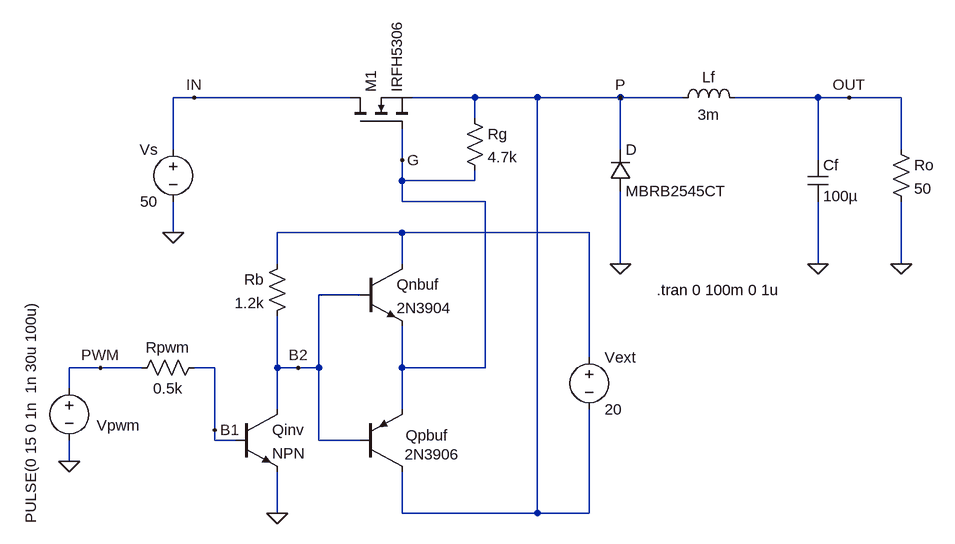
[diagram p0: schematic buck_converter_high_side_mosfet_gate_drive_using_sep_source_pushpull_config_70_duty.asc]
buck_converter_high_side_mosfet_gate_drive_using_sep_source_pushpull_config_70_duty.asc, the LTspice schematic file:
Version 4.1
SHEET 1 1028 932
WIRE -256 128 -288 128
WIRE -16 128 -256 128
WIRE 176 128 80 128
WIRE 272 128 176 128
WIRE 400 128 272 128
WIRE 496 128 400 128
WIRE 704 128 576 128
WIRE 752 128 704 128
WIRE 832 128 752 128
WIRE 176 160 176 128
WIRE -288 208 -288 128
WIRE 400 208 400 128
WIRE 832 208 832 128
WIRE 64 224 64 176
WIRE 704 224 704 128
WIRE 64 256 64 224
WIRE 176 256 176 240
WIRE 176 256 64 256
WIRE 64 288 64 256
WIRE 192 288 64 288
WIRE -288 336 -288 288
WIRE 64 336 -128 336
WIRE 352 336 64 336
WIRE -128 384 -128 336
WIRE 64 384 64 336
WIRE 400 384 400 272
WIRE 704 384 704 288
WIRE 832 384 832 288
WIRE 0 432 -64 432
WIRE 352 528 352 336
WIRE -400 544 -448 544
WIRE -336 544 -400 544
WIRE -224 544 -256 544
WIRE -128 544 -128 464
WIRE -96 544 -128 544
WIRE -64 544 -64 432
WIRE -64 544 -96 544
WIRE 64 544 64 480
WIRE 192 544 192 288
WIRE 192 544 64 544
WIRE -448 576 -448 544
WIRE -128 608 -128 544
WIRE 64 608 64 544
WIRE -224 640 -224 544
WIRE -224 656 -224 640
WIRE -192 656 -224 656
WIRE -64 656 -64 544
WIRE 0 656 -64 656
WIRE -448 688 -448 656
WIRE -128 768 -128 704
WIRE 64 768 64 704
WIRE 272 768 272 128
WIRE 272 768 64 768
WIRE 352 768 352 608
WIRE 352 768 272 768
FLAG 752 128 OUT
FLAG 400 128 P
FLAG 400 384 0
FLAG 832 384 0
FLAG 704 384 0
FLAG -448 688 0
FLAG -288 336 0
FLAG -128 768 0
FLAG 64 224 G
FLAG -400 544 PWM
FLAG -256 128 IN
FLAG -96 544 B2
FLAG -224 640 B1
SYMBOL voltage -288 192 M0
WINDOW 123 0 0 Left 0
WINDOW 39 0 0 Left 0
SYMATTR InstName Vs
SYMATTR Value 50
SYMBOL nmos -16 176 R270
SYMATTR InstName M1
SYMATTR Value IRFH5306
SYMBOL diode 384 272 M180
WINDOW 0 24 64 Left 2
WINDOW 3 24 0 Left 2
SYMATTR InstName D
SYMATTR Value MBRB2545CT
SYMBOL ind 480 144 R270
WINDOW 0 32 56 VTop 2
WINDOW 3 5 56 VBottom 2
SYMATTR InstName Lf
SYMATTR Value 3m
SYMBOL cap 688 224 R0
SYMATTR InstName Cf
SYMATTR Value 100µ
SYMBOL res 816 192 R0
SYMATTR InstName Ro
SYMATTR Value 50
SYMBOL npn 0 384 R0
SYMATTR InstName Qnbuf
SYMATTR Value 2N3904
SYMBOL res -240 528 R90
WINDOW 0 0 56 VBottom 2
WINDOW 3 32 56 VTop 2
SYMATTR InstName Rpwm
SYMATTR Value 0.5k
SYMBOL voltage -448 560 R0
WINDOW 3 -59 224 VLeft 2
WINDOW 123 0 0 Left 0
WINDOW 39 0 0 Left 0
WINDOW 0 42 73 Left 2
SYMATTR Value PULSE(0 15 0 1n  1n 30u 100u)
SYMATTR InstName Vpwm
SYMBOL pnp 0 704 M180
WINDOW 0 70 56 Left 2
WINDOW 3 68 27 Left 2
SYMATTR InstName Qpbuf
SYMATTR Value 2N3906
SYMBOL res -112 368 M0
SYMATTR InstName Rb
SYMATTR Value 1.2k
SYMBOL res 160 144 R0
SYMATTR InstName Rg
SYMATTR Value 4.7k
SYMBOL npn -192 608 R0
SYMATTR InstName Qinv
SYMBOL voltage 352 512 R0
WINDOW 123 0 0 Left 0
WINDOW 39 0 0 Left 0
SYMATTR InstName Vext
SYMATTR Value 20
TEXT 456 424 Left 2 !.tran 0 100m 0 1u

The netlist it stands for:
* buck_converter_high_side_mosfet_gate_drive_using_sep_source_pushpull_config_70_duty.asc
Vs IN 0 50
M1 IN G P P IRFH5306
D 0 P MBRB2545CT
Lf P OUT 3m
Cf OUT 0 100µ
Ro OUT 0 50
Qnbuf N001 B2 G 0 2N3904
Rpwm B1 PWM 0.5k
Vpwm PWM 0 PULSE(0 15 0 1n  1n 30u 100u)
Qpbuf P B2 G 0 2N3906
Rb N001 B2 1.2k
Rg P G 4.7k
Qinv B2 B1 0 0 NPN
Vext N001 P 20
.model D D
.lib standard.dio
.model NPN NPN
.model PNP PNP
.lib standard.bjt
.model NMOS NMOS
.model PMOS PMOS
.lib standard.mos
.tran 0 100m 0 1u
.backanno
.end